# EAGLE design Power Management Tester (EAGLE 6.0)
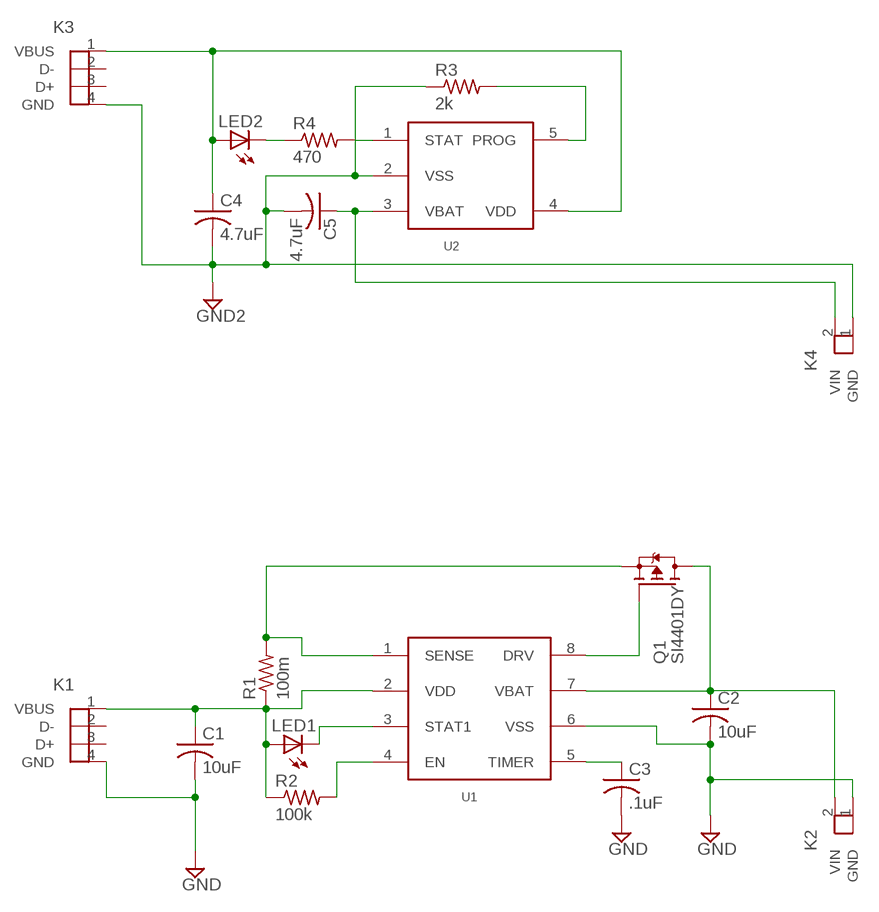
[diagram p0: schematic, sheet 1]

## Parts
C1  10uF  CAP0805  [0805]
C2  10uF  CAP0805  [0805]
C3  .1uF  CAP0603  [0603]
C4  4.7uF  CAP0805  [0805]
C5  4.7uF  CAP0805  [0805]
K1  USBCONN  [USB_RECEPT(CNC)]
K2  PWRCONN  [2CONN]
K3  USBCONN  [USB_RECEPT(CNC)]
K4  PWRCONN  [2CONN]
LED1  LED0805  [0805]
LED2  LED0805  [0805]
Q1  SI4401DY  [8-SOIC]
R1  100m  R0805  [0805]
R2  100k  R0603  [0603]
R3  2k  R0603  [0603]
R4  470  R0603  [0603]
U1  MCP73843  [8-MSOP]
U2  MCP73831  [SOT-23]

## Nets
5V_1: C1.A K1.1(VBUS) LED1.A(POS) R1.A R2.1 U1.2(VDD)
5V_2: C4.A K3.1(VBUS) LED2.A(POS) U2.4(VDD)
D: C2.A K2.2(VIN) Q1.5(D) Q1.6(D) Q1.7(D) Q1.8(D) U1.7(VBAT)
GND1: C1.A1 C2.A1 C3.2 K1.4(GND) K2.1(GND) U1.6(VSS) ; supply symbol labelled GND
GND2: C4.A1 C5.A1 K3.4(GND) K4.1(GND) R3.1 U2.2(VSS)
N$1: C3.1 U1.5(TIMER)
N$3: LED2.A1(NEG) R4.1
N$4: R4.2 U2.1(STAT)
N$5: Q1.1(S) Q1.2(S) Q1.3(S) R1.A1 U1.1(SENSE)
N$6: LED1.A1(NEG) U1.3(STAT1)
N$7: R2.2 U1.4(EN)
N$8: C5.A K4.2(VIN) U2.3(VBAT)
N$9: Q1.4(G) U1.8(DRV)
N$10: R3.2 U2.5(PROG)
Unconnected: K1.2(D-) K1.3(D+) K3.2(D-) K3.3(D+)

## Library data of the parts
C1 C2 C4 C5 = lightsuits:CAP0805
C3 = lightsuits:CAP0603
K1 K3 = lightsuits:USBCONN
K2 K4 = lightsuits:PWRCONN
LED1 LED2 = lightsuits:LED0805
Q1 = lightsuits:SI4401DY
R1 = lightsuits:R0805
R2-R4 = lightsuits:R0603
U1 = lightsuits:MCP73843
U2 = lightsuits:MCP73831

## Board
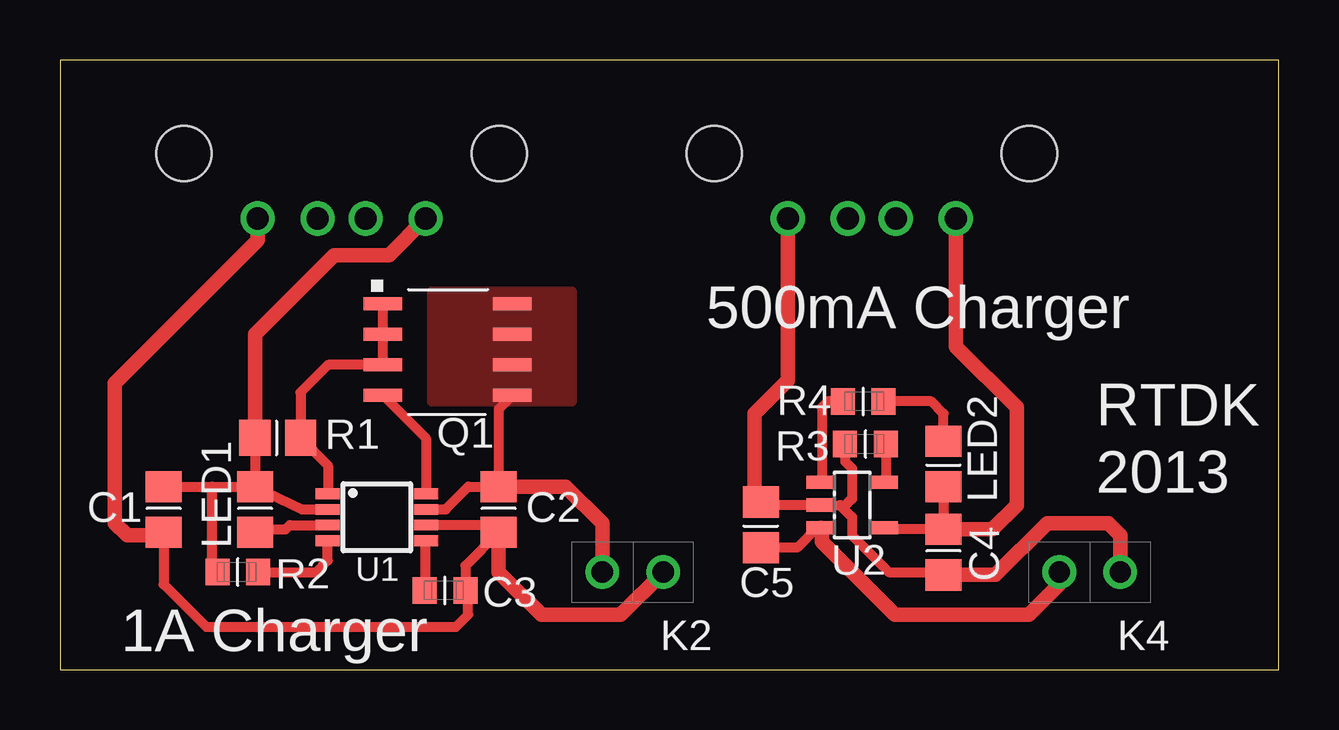
[diagram p1: board, top side]

Size 50.8 x 25.4 mm. Coordinates in mm from the lower left corner, seen from the top.
Outline: 0,0 50.8,0 50.8,25.4 0,25.4 0,0
Copper layers (1*16): Top 0.035mm / dielectric 1.5mm / Bottom 0.035mm
Design rules: minimum track width 10mil, minimum drill 24mil, track to track 8mil, track to pad 8mil, pad to pad 8mil, via to via 8mil, smd to smd 8mil, copper to edge 40mil, drill to drill 8mil, minimum pad ring 10mil, minimum via ring 8mil, stop-mask expansion 4mil, vias tented up to drill 0mil, thermal gap 10mil

### Footprints (pad centres in the part's own frame; a part is rotated, then mirrored left to right if it is on the bottom)
0805 = smd 1.3 x 1.5: A 0,0; A1 1.9,0
0603 = smd 1 x 1.1: 1 -0.8,0; 2 0.9,0
USB_RECEPT(CNC) = drill 0.92: 1 0,0; 2 2.5,0; 3 4.5,0; 4 7,0 | hole 2.3: -3.07,-2.71; 10.07,-2.71
2CONN = drill 0.89: 1 -3.81,0; 2 -1.27,0
8-SOIC = smd 1.6 x 0.55: 1 0,0; 2 0,-1.27; 3 0,-2.54; 4 0,-3.81; 5 5.4,-3.81; 6 5.4,-2.54; 7 5.4,-1.27; 8 5.4,0
8-MSOP = smd 1 x 0.45: 1 2.05,-0.975; 2 2.05,-0.325; 3 2.05,0.325; 4 2.05,0.975; 5 -2.05,0.975; 6 -2.05,0.325; 7 -2.05,-0.325; 8 -2.05,-0.975
SOT-23 = smd 0.55 x 1.2: 1 -0.95,-1.3; 2 0,-1.3; 3 0.95,-1.3; 4 0.95,1.3; 5 -0.95,1.3

### Placement (x,y rotation side)
C1  4.32,7.62 270 top
C2  18.29,7.62 270 top
C3  16,3.3 0 top
C4  36.83,5.84 270 top
C5  29.21,5.08 90 top
K1  15.24,18.8 180 top
K2  21.34,4.06 180 top
K3  37.34,18.8 180 top
K4  40.39,4.06 180 top
LED1  8.13,7.62 270 top
LED2  36.83,7.62 90 top
Q1  13.46,15.24 0 top
R1  8.13,9.65 0 top
R2  7.37,4.06 0 top
R3  33.53,9.4 0 top
R4  33.53,11.18 180 top
U1  13.21,6.35 180 top
U2  33.02,6.86 270 top

### Tracks (layer width: path | path; a pad name or v marks a point on that pad's centre or on a via)
5V_1
  Top 0.406: C1.A 6.35,7.62 | 6.35,7.62 LED1.A | LED1.A 10.09,6.67 U1.2 | R1.A LED1.A | R2.1 6.35,4.28 6.35,7.62
  Top 0.61: K1.1 13.72,17.27 11.43,17.27 8.13,13.97 R1.A
5V_2
  Top 0.406: U2.4 34.29,5.88 34.29,5.84 C4.A LED2.A
  Top 0.61: K3.1 37.34,13.46 39.88,10.92 39.88,6.86 38.86,5.84 C4.A
D
  Top 0.406: Q1.5 18.29,10.86 C2.A 17.02,7.62 16.07,6.67 U1.7
  Top 0.61: K2.2 22.61,6.1 21.08,7.62 C2.A
  pour Top (no thermals): 15.49,15.75 15.49,11.18 21.34,11.18 21.34,15.75
GND1
  Top 0.406: U1.6 17.98,6.03 C2.A1 16.9,4.33 C3.2 17.02,3.3 17.02,2.29 16.51,1.78 6.1,1.78 4.32,3.56 C1.A1
  Top 0.61: K1.4 8.24,17.89 2.29,11.94 2.29,6.1 2.79,5.59 4.19,5.59 C1.A1 | C2.A1 18.29,4.06 20.07,2.29 23.37,2.29 K2.1
GND2
  Top 0.406: 32.64,6.73 32.51,6.86 U2.2 29.33,6.86 C5.A1 | 32.64,6.73 33.02,6.35 33.02,5.59 34.54,4.06 36.71,4.06 C4.A1 | R3.1 32.73,8.67 33.02,8.38 33.02,7.11 32.64,6.73
  Top 0.61: K3.4 30.34,12.05 28.96,10.67 28.96,7.23 C5.A1 | C4.A1 38.99,3.94 41.15,6.1 43.69,6.1 44.2,5.59 K4.1
N$1
  Top 0.406: C3.1 15.24,3.34 15.24,5.36 U1.5
N$3
  Top 0.406: LED2.A1 36.83,10.67 36.32,11.18 R4.1 34.29,11.18
N$4
  Top 0.406: R4.2 32,11.18 31.75,10.92 31.75,7.84 U2.1
N$5
  Top 0.406: U1.1 11.18,7.34 11.18,8.5 R1.A1 10.03,11.55 11.18,12.7 Q1.3 Q1.2 Q1.1
N$6
  Top 0.406: LED1.A1 8.25,5.84 9.4,5.84 9.58,6.03 U1.3
N$7
  Top 0.406: R2.2 10.67,4.06 11.16,4.55 U1.4
N$8
  Top 0.406: U2.3 31.56,5.91 30.73,5.08 C5.A
  Top 0.61: K4.2 41.66,3.56 40.39,2.29 34.8,2.29 31.75,5.33 31.75,5.88 U2.3
N$9
  Top 0.406: Q1.4 15.26,9.63 U1.8
N$10
  Top 0.406: R3.2 34.43,8.01 34.29,7.87 34.29,7.84 U2.5

### Text on the board
tPlace: 500mA Charger | RTDK | 2013 | 1A Charger